# Altium schematic sheet dof_evm.SchDoc
size A4
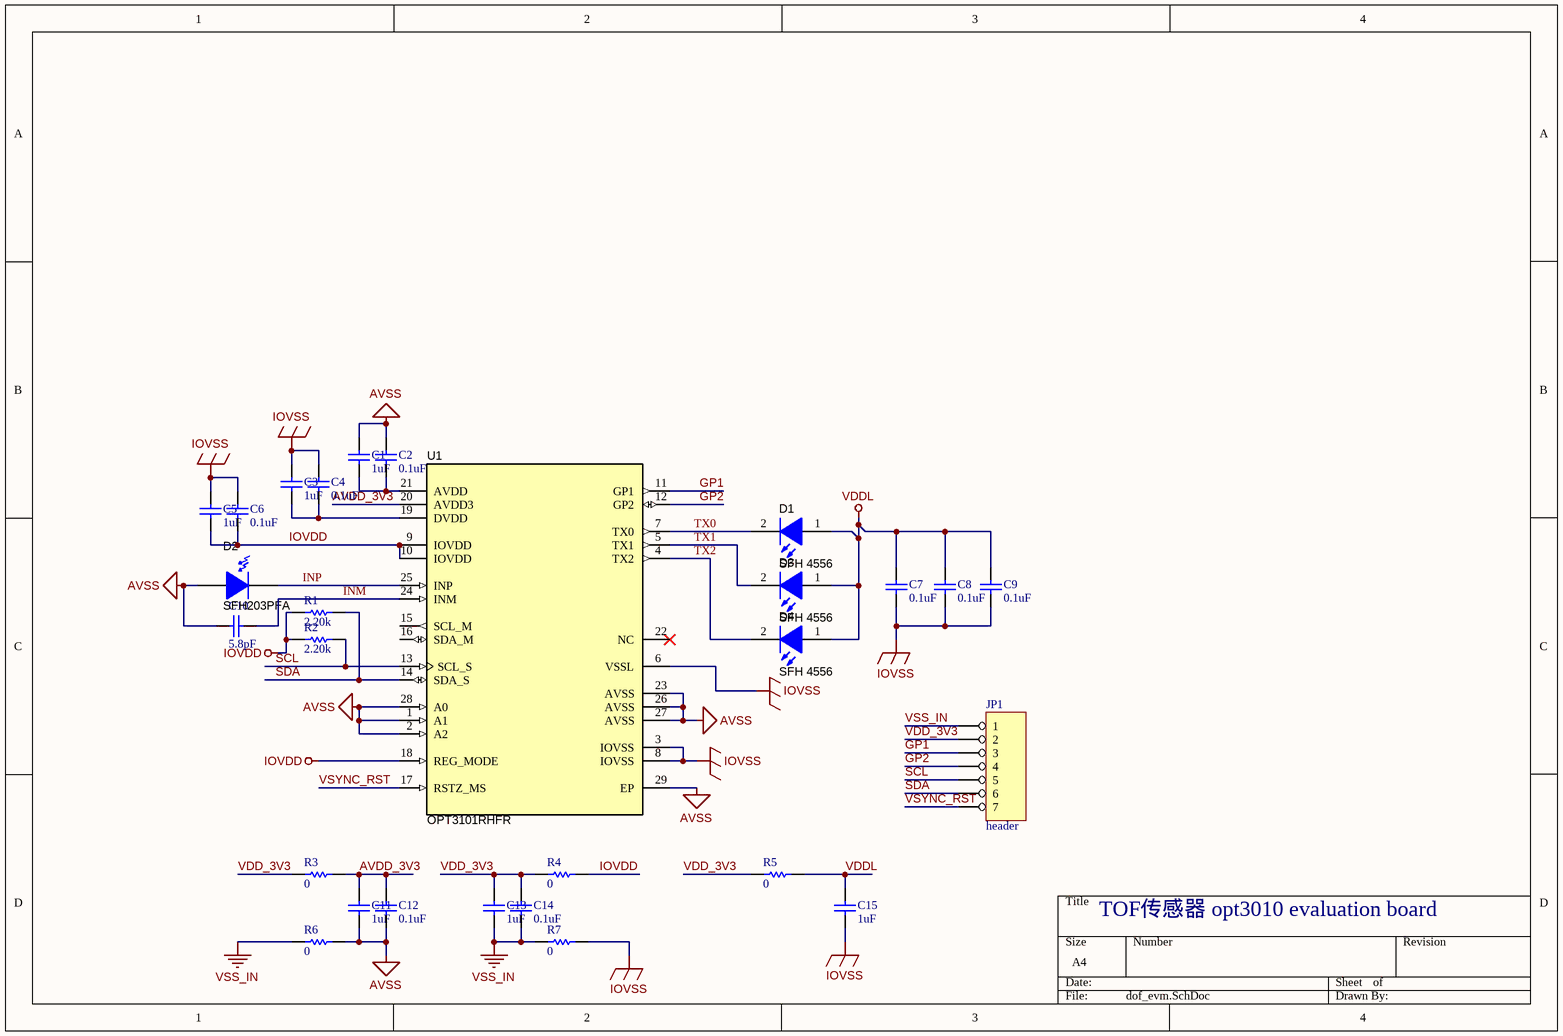
[diagram p0: dof_evm.SchDoc]

## Parts
C1  1uF  [0603_C]
C2  0.1uF  [0603_C]
C3  1uF  [0603_C]
C4  0.1uF  [0603_C]
C5  1uF  [0603_C]
C6  0.1uF  [0603_C]
C7  0.1uF  [0603_C]
C8  0.1uF  [0603_C]
C9  0.1uF  [0603_C]
C10  5.8pF  [0603_C]
C11  1uF  [0603_C]
C12  0.1uF  [0603_C]
C13  1uF  [0603_C]
C14  0.1uF  [0603_C]
C15  1uF  [0603_C]
D1  SFH 4556  [SFH4556]
D2  SFH203PFA  [SFH_213]
D3  SFH 4556  [SFH4556]
D4  SFH 4556  [SFH4556]
JP1  header  [header7]
R1  2.20k  [0603_R]
R2  2.20k  [0603_R]
R3  0  [0603_R]
R4  0  [0603_R]
R5  0  [0603_R]
R6  0  [0603_R]
R7  0  [0603_R]
U1  OPT3101RHFR  [VQFN-28]

## Nets
AVSS: C1.2 C2.2 C10.2 C11.1 C12.1 D2.1(A) R6.2 U1.1(A1) U1.2(A2) U1.23(AVSS) U1.26(AVSS) U1.27(AVSS) U1.28(A0) U1.29(EP)
IOVDD: C5.1 C6.1 R1.1 R2.1 R4.2 U1.9(IOVDD) U1.10(IOVDD) U1.18(REG_MODE)
IOVSS: C3.2 C4.2 C5.2 C6.2 C7.1 C8.1 C9.1 C15.1 R7.2 U1.3(IOVSS) U1.6(VSSL) U1.8(IOVSS)
VDDL: C7.2 C8.2 C9.2 C15.2 D1.1(A) D3.1(A) D4.1(A) R5.2
VSS_IN: C13.1 C14.1 JP1.1 R6.1 R7.1
AVDD_3V3: C11.2 C12.2 R3.2 U1.20(AVDD3)
GP1: JP1.3 U1.11(GP1)
GP2: JP1.4 U1.12(GP2)
INM: C10.1 U1.24(INM)
INP: D2.2(C) U1.25(INP)
SCL: JP1.5 R2.2 U1.13(SCL_S)
SDA: JP1.6 R1.2 U1.14(SDA_S)
TX0: D1.2(K) U1.7(TX0)
TX1: D3.2(K) U1.5(TX1)
TX2: D4.2(K) U1.4(TX2)
VDD_3V3: C13.2 C14.2 JP1.2 R3.1 R4.1 R5.1
VSYNC_RST: JP1.7 U1.17(RSTZ_MS)
NetC1_1: C1.1 C2.1 U1.21(AVDD)
NetC3_1: C3.1 C4.1 U1.19(DVDD)

Not connected (* = marked no-connect by the designer): U1 15(SCL_M) 16(SDA_M) 22(NC)*

## Notes on the sheet
- TOF传感器 opt3010 evaluation board

## Library data of the parts
C1-C15 = CAP: Capacitor; Value: 104; Published: 8-Jun-2000; LatestRevisionDate: 17-Jul-2002; LatestRevisionNote: Re-released for DXP Platform.; PackageReference: RAD-0.3; Publisher: Altium Limited
D1 D3 D4 = SFH 4556: LED, Infrared, TH; Manufacturer: OSRAM; SizeAreaWB_mm2: 53.8125; Vr_V: 5V; Power_TotalModule: 180mW; Angle: 40; SizeArea_mm2: 28.4625; SizeZ_mm: 11.1; Io_A: 1dA; Vf_V: 1.5V; SizeY_mm: 5.5; U/M: EA; Value1: .18W; SizeX_mm: 5.175; ComponentLink1Description: Datasheet link; RoHS: Y; Supplier 1: Digi-Key; PackageReference: D5.5mm; Value: Infrared; Color: Infrared; PartNumber: SFH 4556; Publisher: Texas Instruments; Supplier Part Number 2: 720-SFH4556; Supplier 2: Mouser; Published: 2008-07-11; Value2: 1.5V; ComponentLink1URL: http://www.osram-os.com/Graphics/XPic7/00209781_0.pdf; LatestRevisionDate: 2017-10-03; CompType: LED; MountType: TH; Supplier Part Number 1: 475-2871-ND; Type: ?
D2 = SFH203PFA: Silicon PIN Photodiode, TH; Manufacturer: OSRAM; SizeArea_mm2: 32.49; SizeAreaWB_mm2: 59.29; SizeY_mm: 5.7; SizeZ_mm: 7.75; PartNumber: SFH203PFA; PackageReference: TH, 2-Leads, Dia 5.7mm; CompType: Photo Diode; ComponentLink1Description: Datasheet URL; MountType: TH; ComponentLink1URL: https://dammedia.osram.info/media/resource/hires/osram-dam-5488335/SFH%20203%20PFA_EN.pdf; RoHS: Y; SizeX_mm: 5.7
JP1 = HEADER 7
R1-R7 = RES: Resistor; Value: 1K; Published: 8-Jun-2000; Revision: July-2002: Re-released for DXP Platform.; Publisher: Altium Limited
U1 = OPT3101RHFR: Long Range Proximity/Depth Sensor, RHF0028A (VQFN-28); Alternate PartNumber: OPT3101RHFT; Manufacturer: Texas Instruments; SizeZ_mm: 1.0; SizeX_mm: 4.0; SizeY_mm: 5.0; SizeArea_mm2: 20.0; CompType: IC; U/M: EA; SizeAreaWB_mm2: 42.0; ComponentLink1URL: https://sps06.itg.ti.com/sites/KMS/crossdivteams/altium/docs/ComponentDatasheets/OPT3101_Customer_Datasheet_v2p2.pdf; PackageDescription: VQFN-28; Publisher: Texas Instruments; PackageReference: RHF0028A; LatestRevisionDate: 2017-06-23; PartNumber: OPT3101RHFR; ComponentLink1Description: Datasheet Link; MountType: SMT; Alternate Manufacturer: Texas Instruments